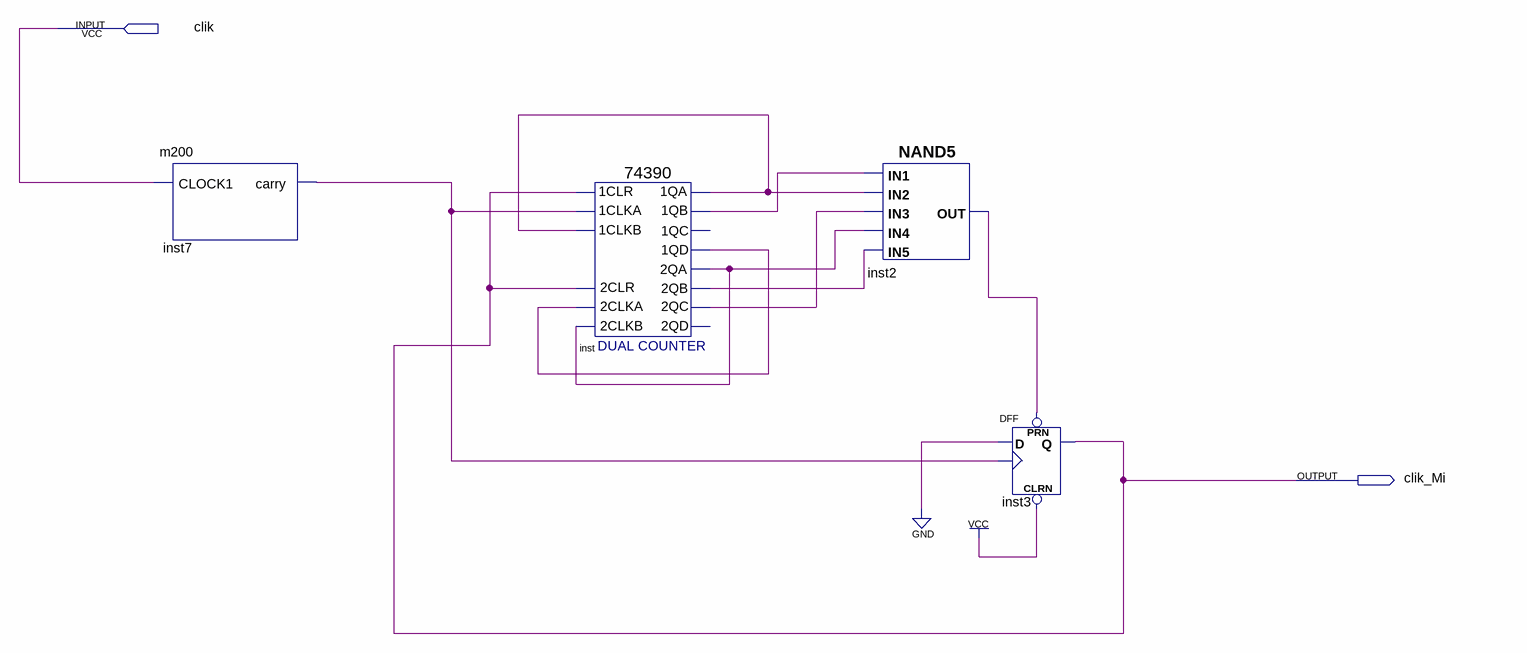
[diagram p0: schematic sheet]
// Quartus schematic Mi.bdf as structural Verilog: 4 symbols, 2 pins
module Mi (
  input  clik,
  output clik_Mi
);

  wire inst2_out, inst7_carry, inst_1qa, inst_1qb, inst_1qd, inst_2qa, inst_2qb, inst_2qc;

  m200 inst7 (.CLOCK1(clik), .carry(inst7_carry));
  \74390  inst (
    .\2CLKA (inst_1qd), .\2CLR (clik_Mi), .\2CLKB (inst_2qa), .\1CLR (clik_Mi), .\1CLKA (inst7_carry),
    .\1CLKB (inst_1qa), .\1QA (inst_1qa), .\1QB (inst_1qb), .\1QD (inst_1qd), .\2QA (inst_2qa),
    .\2QB (inst_2qb), .\2QC (inst_2qc));  // open: 1QC, 2QD
  nand inst2 (inst2_out, inst_1qb, inst_1qa, inst_2qc, inst_2qa, inst_2qb);
  DFF inst3 (.CLRN(1'b1), .CLK(inst7_carry), .D(1'b0), .PRN(inst2_out), .Q(clik_Mi));
endmodule
